# Altium schematic sheet Main.SchDoc
size Legal
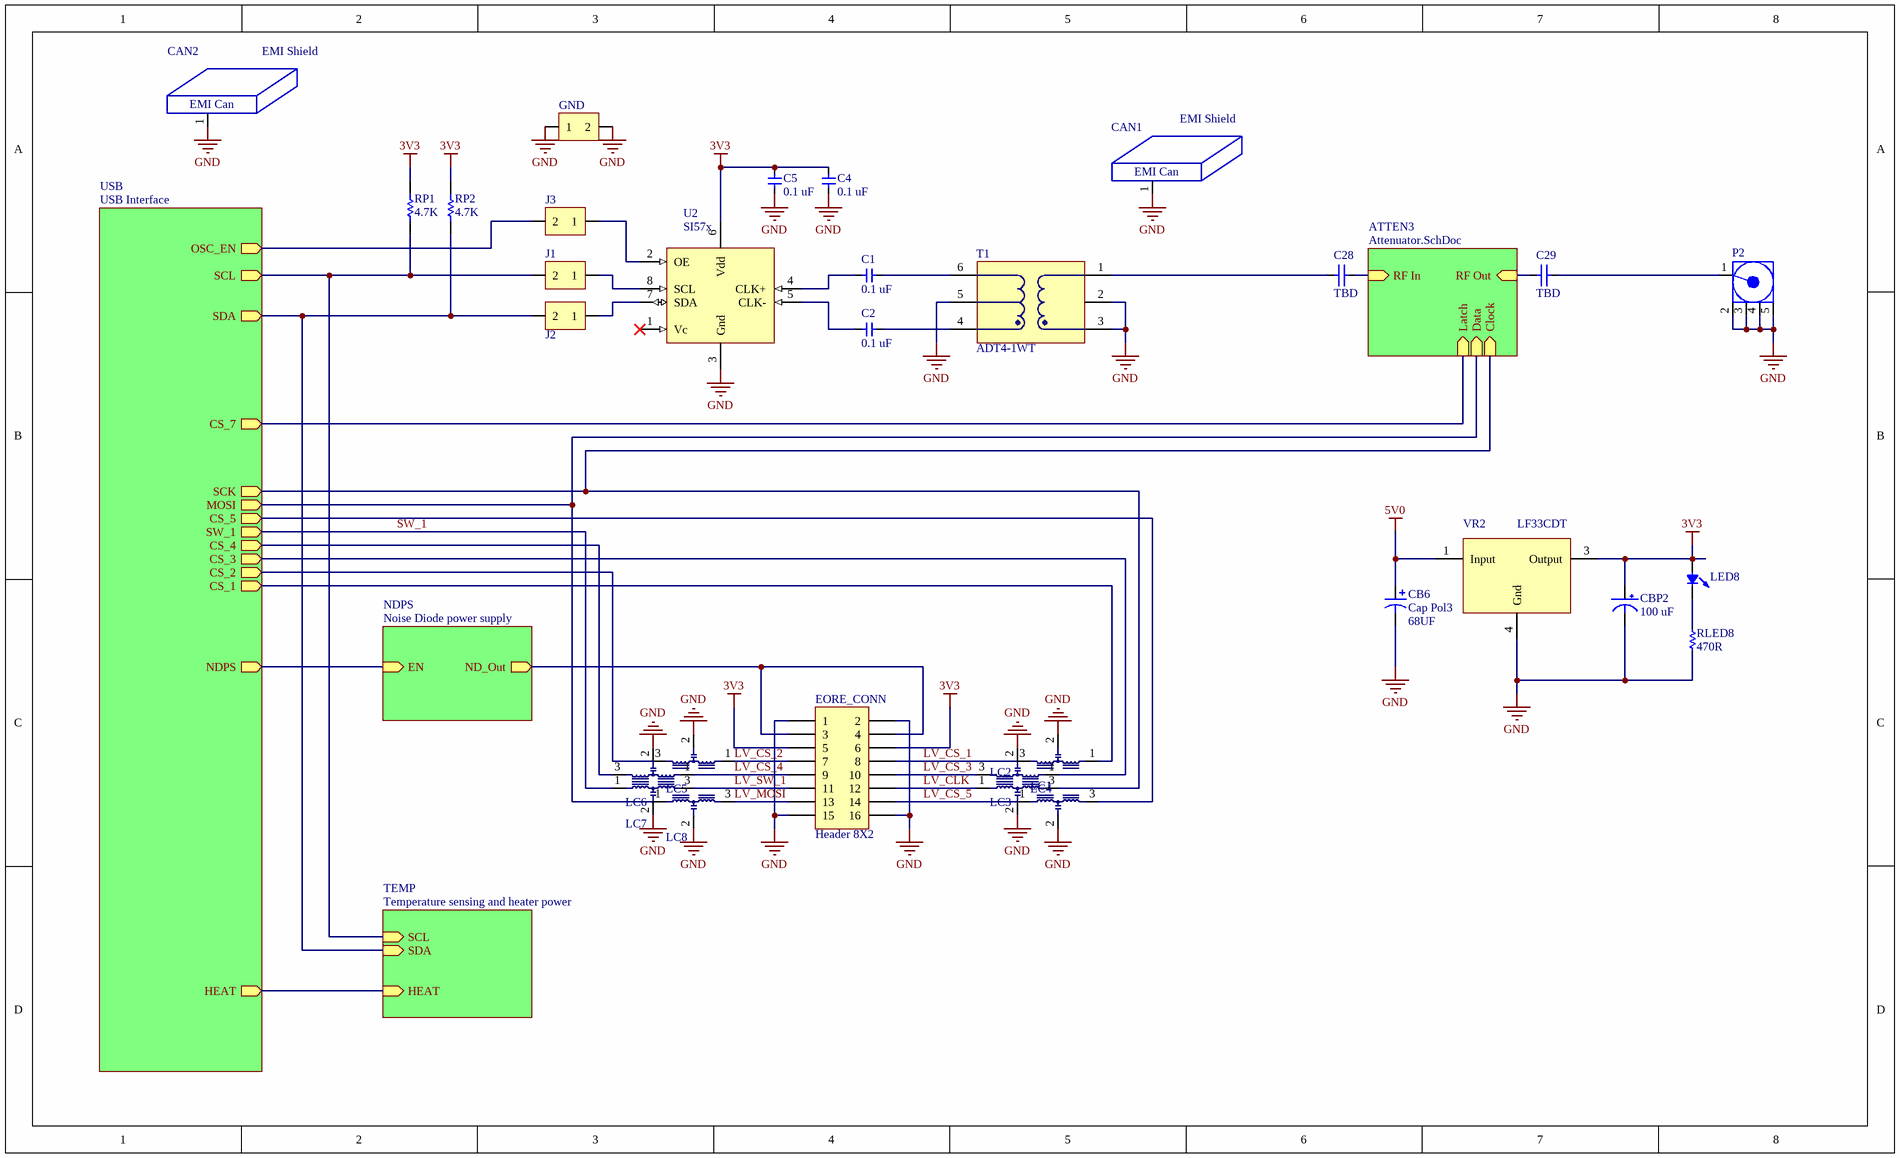
[diagram p0: Main.SchDoc]

## Parts
C1  value 0.1 uF  [0603C]  (hidden comment: SMT Cap)
C2  value 0.1 uF  [0603C]  (hidden comment: SMT Cap)
C4  value 0.1 uF  [0603C]  (hidden comment: SMT Cap)
C5  value 0.1 uF  [0603C]  (hidden comment: SMT Cap)
C28  value TBD  [0402C]  (hidden comment: Cap)
C29  value TBD  [0402C]  (hidden comment: Cap)
CAN1  EMI Shield  [BMI-S-205-F]
CAN2  EMI Shield  [BMI-S-230-F-R]
CB6  Cap Pol3  value 68UF  [V]
CBP2  100 uF  [B]
EORE_CONN  Header 8X2  [SMT 16-pin rectangular header]
GND  Jumper  [HDR1X2]  (value not drawn)
J1  Jumper  [0603R]  (value not drawn)
J2  Jumper  [0603R]  (value not drawn)
J3  Jumper  [0603R]  (value not drawn)
LC1  MEM2012F  [MEM2012S LC Filter]  (value not drawn)
LC2  MEM2012F  [MEM2012S LC Filter]  (value not drawn)
LC3  MEM2012F  [MEM2012S LC Filter]  (value not drawn)
LC4  MEM2012F  [MEM2012S LC Filter]  (value not drawn)
LC5  MEM2012F  [MEM2012S LC Filter]  (value not drawn)
LC6  MEM2012F  [MEM2012S LC Filter]  (value not drawn)
LC7  MEM2012F  [MEM2012S LC Filter]  (value not drawn)
LC8  MEM2012F  [MEM2012S LC Filter]  (value not drawn)
LED8  LED0  [T1 LED]  (value not drawn)
P2  COAX-M  [SMA Jack - PCB Edge - MultiSize]  (value not drawn)
RLED8  value 470R  [0603R]  (hidden comment: Res Semi Small)
RP1  value 4.7K  [0603R]  (hidden comment: Res Semi)
RP2  value 4.7K  [0603R]  (hidden comment: Res Semi)
T1  ADT4-1WT  [CD542]
U2  SI57x  [SI57x]
VR2  LF33CDT  [TO228P1000-3_4N]

## Sub-sheets
ATTEN3 = Attenuator.SchDoc: RF In (in), RF Out (in), Clock (in), Data (in), Latch (in)
NDPS = Noise Diode power supply: EN (in), ND_Out (out)
TEMP = Temperature sensing and heater power: SCL (in), SDA (in), HEAT (in)
USB = USB Interface: SCL (out), SDA (out), SCK (out), MOSI (out), CS_1 (out), CS_2 (out), CS_3 (out), CS_4 (out), SW_1 (out), CS_5 (out), NDPS (out), OSC_EN (out), CS_7 (out), HEAT (out)

## Nets
3V3: C4.2 C5.2 CBP2.1 EORE_CONN.5 EORE_CONN.6 LED8.1 RP1.2 RP2.2 U2.6(Vdd) VR2.3(Output)
5V0: CB6.1 VR2.1(Input)
GND: C4.1 C5.1 CAN1.1 CAN2.1 CB6.2 CBP2.2 EORE_CONN.1 EORE_CONN.2 EORE_CONN.15 EORE_CONN.16 GND.1 GND.2 LC1.2 LC2.2 LC3.2 LC4.2 LC5.2 LC6.2 LC7.2 LC8.2 P2.2(GND) P2.3(GND) P2.4(GND) P2.5(GND) RLED8.2 T1.2(Gnd) T1.3(Coupled) T1.5(Termination) U2.3(Gnd) VR2.4(Gnd)
LV_CLK: EORE_CONN.12 LC2.1
LV_CS_1: EORE_CONN.8 LC4.3
LV_CS_2: EORE_CONN.7 LC5.1
LV_CS_3: EORE_CONN.10 LC3.3
LV_CS_4: EORE_CONN.9 LC6.1
LV_CS_5: EORE_CONN.14 LC1.1
LV_MOSI: EORE_CONN.13 LC8.3
LV_SW_1: EORE_CONN.11 LC7.3
SW_1: LC7.1 ; sheet USB/SW_1
NetC1_1: C1.1 U2.4(CLK+)
NetC1_2: C1.2 T1.6(Output)
NetC2_1: C2.1 U2.5(CLK-)
NetC2_2: C2.2 T1.4(Termination)
NetC28_1: C28.1 T1.1(Input)
NetC28_2: C28.2 ; sheet ATTEN3/RF In
NetC29_1: C29.1 ; sheet ATTEN3/RF Out
NetC29_2: C29.2 P2.1(Signal)
NetEORE_CONN_3: EORE_CONN.3 EORE_CONN.4 ; sheet NDPS/ND_Out
NetJ1_1: J1.1 U2.8(SCL)
NetJ1_2: J1.2 RP1.1 ; sheet USB/SCL, sheet TEMP/SCL
NetJ2_1: J2.1 U2.7(SDA)
NetJ2_2: J2.2 RP2.1 ; sheet USB/SDA, sheet TEMP/SDA
NetJ3_1: J3.1 U2.2(OE)
NetJ3_2: J3.2 ; sheet USB/OSC_EN
NetLC1_3: LC1.3 ; sheet USB/CS_5
NetLC2_3: LC2.3 ; sheet USB/SCK, sheet ATTEN3/Clock
NetLC3_1: LC3.1 ; sheet USB/CS_3
NetLC4_1: LC4.1 ; sheet USB/CS_1
NetLC5_3: LC5.3 ; sheet USB/CS_2
NetLC6_3: LC6.3 ; sheet USB/CS_4
NetLC8_1: LC8.1 ; sheet USB/MOSI, sheet ATTEN3/Data
NetLED8_2: LED8.2 RLED8.1
(unnamed): sheet USB/NDPS, sheet NDPS/EN
(unnamed): sheet USB/CS_7, sheet ATTEN3/Latch
(unnamed): sheet USB/HEAT, sheet TEMP/HEAT

Not connected (* = marked no-connect by the designer): U2 1(Vc)*

## Notes on the sheet
- (in symbol BMI-S-205-F RF/EMI Can) EMI Can
- (in symbol BMI-S-230-F-R RF/EMI Can) EMI Can

## Library data of the parts
C1 C2 C4 C5 = Cap - SMT Small: Published: 8-Jun-2000; LatestRevisionDate: 29-May-2009; LatestRevisionNote: IPC-7351 Footprint Added.; PackageReference: C1206; Publisher: Altium Limited; PackageDescription: Chip Capacitor
C28 C29 = Cap: Capacitor; Published: 8-Jun-2000; LatestRevisionDate: 17-Jul-2002; LatestRevisionNote: Re-released for DXP Platform.; PackageReference: RAD-0.3; Publisher: Altium Limited
CAN1 = BMI-S-205-F RF/EMI Can: Laird Technologies 2-part EMI can; DKPN: Base: 903-1054-1-ND Cover: 903-1017-ND
CAN2 = BMI-S-230-F-R RF/EMI Can: Laird Technologies 2-part EMI can; DKPN: Base: 903-1470-1-ND Cover: 903-1471-ND
CB6 = Cap Pol3: KEMET T520 KO-CAP  Polymer SMT Tantalum; DKPN: 399-3330-1-ND; Voltage: 10V; Type: KEMET T520 KO-CAP  Polymer SMT Tantalum
CBP2 = 100 uf SMT Panasonic Cap
EORE_CONN = Header 8X2: Header, 8-Pin, Dual row; LatestRevisionDate: 17-Jul-2002; LatestRevisionNote: Re-released for DXP Platform.; Publisher: Altium Limited
GND J1-J3 = Jumper - 2 Pin: Jumper - 2-Pin; LatestRevisionDate: 17-Jul-2002; LatestRevisionNote: Re-released for DXP Platform.; Publisher: Altium Limited
LC1-LC8 = MEM2012F - Signal Filter: Signal Line 3-terminal Filters
LED8 = LED0: T 1 3/4 LED; Published: 8-Jun-2000; LatestRevisionDate: 08-Jul-2005; LatestRevisionNote: Mech Layer 1 removed.; PackageReference: LED-0; Publisher: Altium Limited
P2 = COAX-M: RF Coaxial PCB Connector, MMCX; Thru-Hole, Vertical Mount Plug,  50 Ohm Impedance; PackageDocument: Rev. A, 16-Jun-1997; PCB_Layout: Complies with manufacturer's recommendation.; DrillSize: Corresponds to nominal value.; Published: 15-Jul-2004; LatestRevisionDate: 15-Jul-2004; LatestRevisionNote: Component Replaced.; DatasheetDocument: 30-May-2003; PackageReference: 908-21103; Publisher: Altium Limited; ComponentLink1Description: Manufacturer Link; ComponentLink1URL: http://www.amphenolrf.com/
RLED8 = Res Semi Small: Semiconductor Resistor; Published: 8-Jun-2000; LatestRevisionDate: 17-Jul-2002; LatestRevisionNote: Re-released for DXP Platform.; PackageReference: AXIAL-0.5; Publisher: Altium Limited
RP1 RP2 = Res Semi: Semiconductor Resistor; Published: 8-Jun-2000; LatestRevisionDate: 17-Jul-2002; LatestRevisionNote: Re-released for DXP Platform.; PackageReference: AXIAL-0.5; Publisher: Altium Limited
T1 = ADT4-1WT: Surface Mount RF Transformer
U2 = SI570: 10 MHZ TO 1.4 GHZ I2C PROGRAMMABLE XO/VCXO
VR2 = LF33CDT: Very low drop 500 ma voltage regulators; DKPN: 497-1532-1-ND